# EAGLE design logic (EAGLE 6.4)

## Sheet 1 of 6
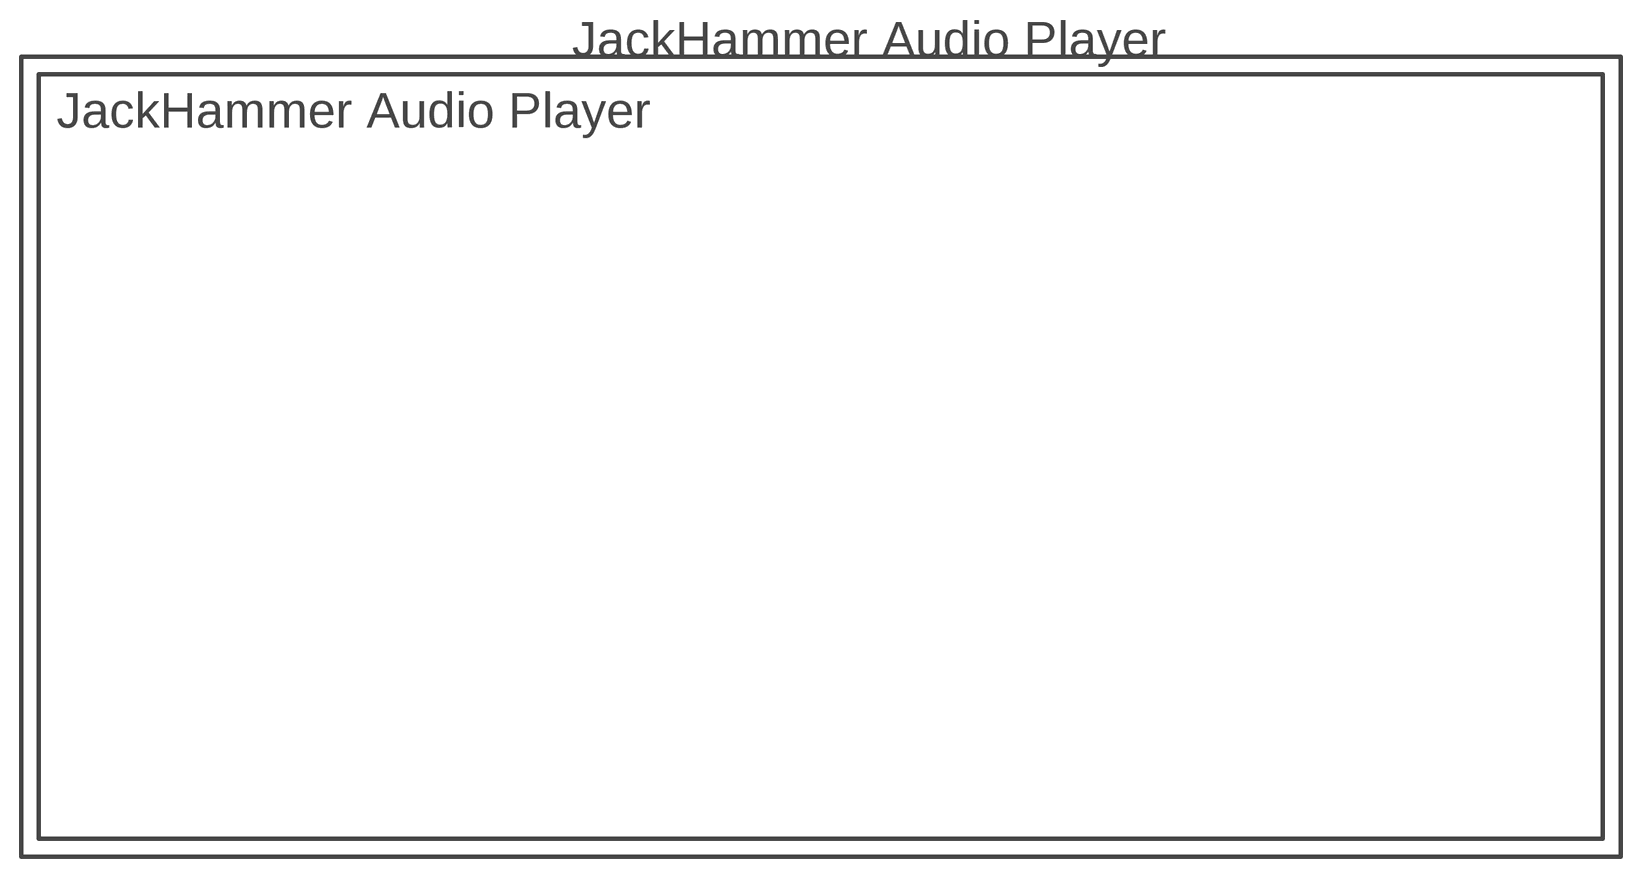
[diagram p0: schematic, sheet 1]

### Notes on the sheet
- JackHammer Audio Player
- JackHammer Audio Player

## Sheet 2 of 6: Positive
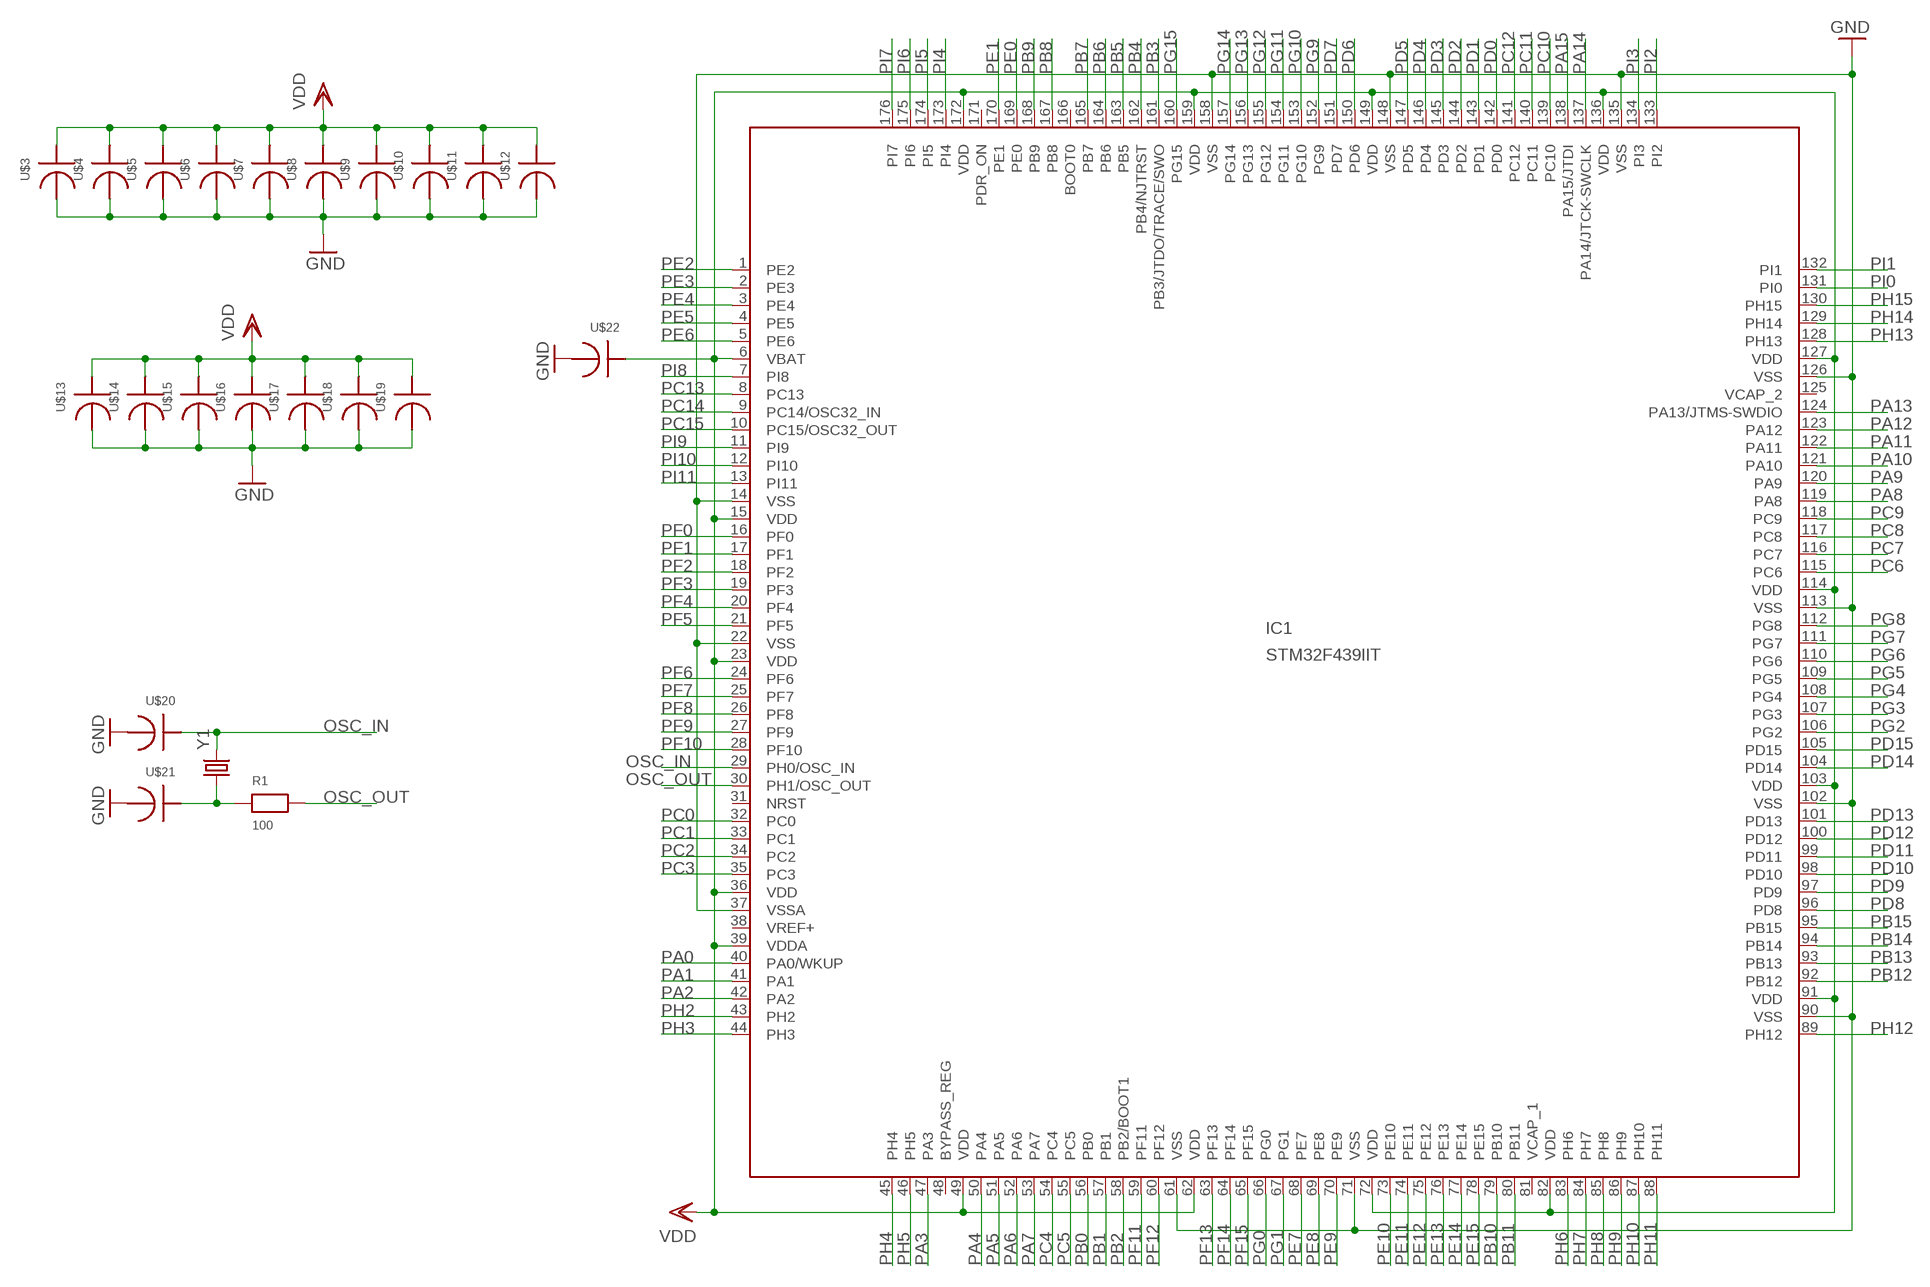
[diagram p1: schematic, sheet 2]

### Parts
IC1  STM32F439IIT  [LQFP-176]
R1  100  PRES0402LEVEL3  [R0402]
U$3  PCAP0402LEVEL3  [R0402]
U$4  PCAP0402LEVEL3  [R0402]
U$5  PCAP0402LEVEL3  [R0402]
U$6  PCAP0402LEVEL3  [R0402]
U$7  PCAP0402LEVEL3  [R0402]
U$8  PCAP0402LEVEL3  [R0402]
U$9  PCAP0402LEVEL3  [R0402]
U$10  PCAP0402LEVEL3  [R0402]
U$11  PCAP0402LEVEL3  [R0402]
U$12  PCAP0402LEVEL3  [R0402]
U$13  PCAP0402LEVEL3  [R0402]
U$14  PCAP0402LEVEL3  [R0402]
U$15  PCAP0402LEVEL3  [R0402]
U$16  PCAP0402LEVEL3  [R0402]
U$17  PCAP0402LEVEL3  [R0402]
U$18  PCAP0402LEVEL3  [R0402]
U$19  PCAP0402LEVEL3  [R0402]
U$20  PCAP0402LEVEL3  [R0402]
U$21  PCAP0402LEVEL3  [R0402]
U$22  PCAP0402LEVEL3  [R0402]
Y1  CRYSTALHC49US  [HC49US]

### Nets
GND: IC1.14(VSS) IC1.22(VSS) IC1.37(VSSA) IC1.61(VSS) IC1.71(VSS) IC1.90(VSS) IC1.102(VSS) IC1.113(VSS) IC1.126(VSS) IC1.135(VSS) IC1.148(VSS) IC1.158(VSS) U$3.P$1 U$4.P$1 U$5.P$1 U$6.P$1 U$7.P$1 U$8.P$1 U$9.P$1 U$10.P$1 U$11.P$1 U$12.P$1 U$13.P$1 U$14.P$1 U$15.P$1 U$16.P$1 U$17.P$1 U$18.P$1 U$19.P$1 U$20.P$1 U$21.P$1 U$22.P$1 ; also sheet 3,4,6
N$2: R1.P$1 U$21.P$2 Y1.1
OSC_IN: IC1.29(PH0/OSC_IN) U$20.P$2 Y1.2
OSC_OUT: IC1.30(PH1/OSC_OUT) R1.P$2
PA0: IC1.40(PA0/WKUP)
PA1: IC1.41(PA1)
PA2: IC1.42(PA2)
PA3: IC1.47(PA3)
PA4: IC1.50(PA4)
PA5: IC1.51(PA5)
PA6: IC1.52(PA6)
PA7: IC1.53(PA7)
PA8: IC1.119(PA8)
PA9: IC1.120(PA9)
PA10: IC1.121(PA10)
PA11: IC1.122(PA11)
PA12: IC1.123(PA12)
PA13: IC1.124(PA13/JTMS-SWDIO)
PA14: IC1.137(PA14/JTCK-SWCLK)
PA15: IC1.138(PA15/JTDI)
PB0: IC1.56(PB0)
PB1: IC1.57(PB1)
PB2: IC1.58(PB2/BOOT1) ; also sheet 6
PB3: IC1.161(PB3/JTDO/TRACE/SWO)
PB4: IC1.162(PB4/NJTRST)
PB5: IC1.163(PB5) ; also sheet 3
PB6: IC1.164(PB6) ; also sheet 3
PB7: IC1.165(PB7)
PB8: IC1.167(PB8) ; also sheet 4
PB9: IC1.168(PB9) ; also sheet 4
PB10: IC1.79(PB10) ; also sheet 6
PB11: IC1.80(PB11)
PB12: IC1.92(PB12)
PB13: IC1.93(PB13)
PB14: IC1.94(PB14) ; also sheet 6
PB15: IC1.95(PB15) ; also sheet 6
PC0: IC1.32(PC0) ; also sheet 3
PC1: IC1.33(PC1)
PC2: IC1.34(PC2)
PC3: IC1.35(PC3)
PC4: IC1.54(PC4)
PC5: IC1.55(PC5)
PC6: IC1.115(PC6) ; also sheet 4
PC7: IC1.116(PC7) ; also sheet 4
PC8: IC1.117(PC8) ; also sheet 4
PC9: IC1.118(PC9) ; also sheet 4
PC10: IC1.139(PC10) ; also sheet 4
PC11: IC1.140(PC11) ; also sheet 4
PC12: IC1.141(PC12) ; also sheet 4
PC13: IC1.8(PC13) ; also sheet 6
PC14: IC1.9(PC14/OSC32_IN) ; also sheet 6
PC15: IC1.10(PC15/OSC32_OUT) ; also sheet 6
PD0: IC1.142(PD0) ; also sheet 3
PD1: IC1.143(PD1) ; also sheet 3
PD2: IC1.144(PD2) ; also sheet 4
PD3: IC1.145(PD3)
PD4: IC1.146(PD4)
PD5: IC1.147(PD5)
PD6: IC1.150(PD6)
PD7: IC1.151(PD7)
PD8: IC1.96(PD8) ; also sheet 3
PD9: IC1.97(PD9) ; also sheet 3
PD10: IC1.98(PD10) ; also sheet 3
PD11: IC1.99(PD11)
PD12: IC1.100(PD12)
PD13: IC1.101(PD13)
PD14: IC1.104(PD14) ; also sheet 3
PD15: IC1.105(PD15) ; also sheet 3
PE0: IC1.169(PE0) ; also sheet 3
PE1: IC1.170(PE1) ; also sheet 3
PE2: IC1.1(PE2)
PE3: IC1.2(PE3)
PE4: IC1.3(PE4)
PE5: IC1.4(PE5)
PE6: IC1.5(PE6)
PE7: IC1.68(PE7) ; also sheet 3
PE8: IC1.69(PE8) ; also sheet 3
PE9: IC1.70(PE9) ; also sheet 3
PE10: IC1.73(PE10) ; also sheet 3
PE11: IC1.74(PE11) ; also sheet 3
PE12: IC1.75(PE12) ; also sheet 3
PE13: IC1.76(PE13) ; also sheet 3
PE14: IC1.77(PE14) ; also sheet 3
PE15: IC1.78(PE15) ; also sheet 3
PF0: IC1.16(PF0) ; also sheet 3
PF1: IC1.17(PF1) ; also sheet 3
PF2: IC1.18(PF2) ; also sheet 3
PF3: IC1.19(PF3) ; also sheet 3
PF4: IC1.20(PF4) ; also sheet 3
PF5: IC1.21(PF5) ; also sheet 3
PF6: IC1.24(PF6)
PF7: IC1.25(PF7)
PF8: IC1.26(PF8)
PF9: IC1.27(PF9)
PF10: IC1.28(PF10)
PF11: IC1.59(PF11) ; also sheet 3
PF12: IC1.60(PF12) ; also sheet 3
PF13: IC1.63(PF13) ; also sheet 3
PF14: IC1.64(PF14) ; also sheet 3
PF15: IC1.65(PF15) ; also sheet 3
PG0: IC1.66(PG0) ; also sheet 3
PG1: IC1.67(PG1) ; also sheet 3
PG2: IC1.106(PG2)
PG3: IC1.107(PG3)
PG4: IC1.108(PG4) ; also sheet 3
PG5: IC1.109(PG5) ; also sheet 3
PG6: IC1.110(PG6)
PG7: IC1.111(PG7)
PG8: IC1.112(PG8) ; also sheet 3
PG9: IC1.152(PG9)
PG10: IC1.153(PG10)
PG11: IC1.154(PG11)
PG12: IC1.155(PG12)
PG13: IC1.156(PG13)
PG14: IC1.157(PG14)
PG15: IC1.160(PG15) ; also sheet 3
PH2: IC1.43(PH2)
PH3: IC1.44(PH3)
PH4: IC1.45(PH4)
PH5: IC1.46(PH5)
PH6: IC1.83(PH6)
PH7: IC1.84(PH7)
PH8: IC1.85(PH8)
PH9: IC1.86(PH9)
PH10: IC1.87(PH10)
PH11: IC1.88(PH11)
PH12: IC1.89(PH12)
PH13: IC1.128(PH13)
PH14: IC1.129(PH14)
PH15: IC1.130(PH15)
PI0: IC1.131(PI0)
PI1: IC1.132(PI1)
PI2: IC1.133(PI2)
PI3: IC1.134(PI3)
PI4: IC1.173(PI4)
PI5: IC1.174(PI5)
PI6: IC1.175(PI6)
PI7: IC1.176(PI7)
PI8: IC1.7(PI8)
PI9: IC1.11(PI9)
PI10: IC1.12(PI10)
PI11: IC1.13(PI11)
VDD: IC1.6(VBAT) IC1.15(VDD) IC1.23(VDD) IC1.36(VDD) IC1.39(VDDA) IC1.49(VDD) IC1.62(VDD) IC1.72(VDD) IC1.82(VDD) IC1.91(VDD) IC1.103(VDD) IC1.114(VDD) IC1.127(VDD) IC1.136(VDD) IC1.149(VDD) IC1.159(VDD) IC1.172(VDD) U$3.P$2 U$4.P$2 U$5.P$2 U$6.P$2 U$7.P$2 U$8.P$2 U$9.P$2 U$10.P$2 U$11.P$2 U$12.P$2 U$13.P$2 U$14.P$2 U$15.P$2 U$16.P$2 U$17.P$2 U$18.P$2 U$19.P$2 U$22.P$2 ; also sheet 3,4
Unconnected: IC1.31(NRST) IC1.48(BYPASS_REG) IC1.166(BOOT0)

## Sheet 3 of 6
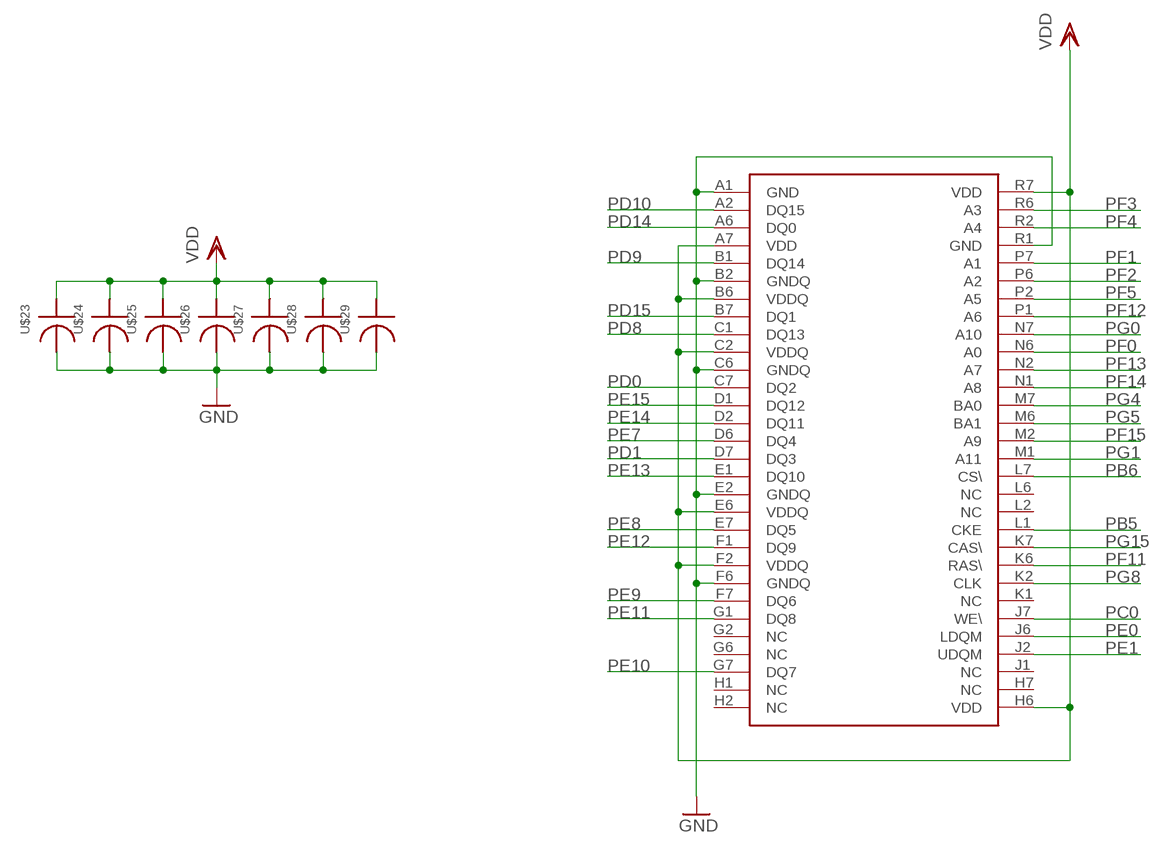
[diagram p2: schematic, sheet 3]

### Parts
U$2  IS42S16400J-BGA60  [BGA-60]
U$23  PCAP0402LEVEL3  [R0402]
U$24  PCAP0402LEVEL3  [R0402]
U$25  PCAP0402LEVEL3  [R0402]
U$26  PCAP0402LEVEL3  [R0402]
U$27  PCAP0402LEVEL3  [R0402]
U$28  PCAP0402LEVEL3  [R0402]
U$29  PCAP0402LEVEL3  [R0402]

### Nets
GND: U$2.A1(GND) U$2.B2(GNDQ) U$2.C6(GNDQ) U$2.E2(GNDQ) U$2.F6(GNDQ) U$2.R1(GND) U$23.P$1 U$24.P$1 U$25.P$1 U$26.P$1 U$27.P$1 U$28.P$1 U$29.P$1 ; also sheet 2,4,6
PB5: U$2.L1(CKE) ; also sheet 2
PB6: U$2.L7(CS\) ; also sheet 2
PC0: U$2.J7(WE\) ; also sheet 2
PD0: U$2.C7(DQ2) ; also sheet 2
PD1: U$2.D7(DQ3) ; also sheet 2
PD8: U$2.C1(DQ13) ; also sheet 2
PD9: U$2.B1(DQ14) ; also sheet 2
PD10: U$2.A2(DQ15) ; also sheet 2
PD14: U$2.A6(DQ0) ; also sheet 2
PD15: U$2.B7(DQ1) ; also sheet 2
PE0: U$2.J6(LDQM) ; also sheet 2
PE1: U$2.J2(UDQM) ; also sheet 2
PE7: U$2.D6(DQ4) ; also sheet 2
PE8: U$2.E7(DQ5) ; also sheet 2
PE9: U$2.F7(DQ6) ; also sheet 2
PE10: U$2.G7(DQ7) ; also sheet 2
PE11: U$2.G1(DQ8) ; also sheet 2
PE12: U$2.F1(DQ9) ; also sheet 2
PE13: U$2.E1(DQ10) ; also sheet 2
PE14: U$2.D2(DQ11) ; also sheet 2
PE15: U$2.D1(DQ12) ; also sheet 2
PF0: U$2.N6(A0) ; also sheet 2
PF1: U$2.P7(A1) ; also sheet 2
PF2: U$2.P6(A2) ; also sheet 2
PF3: U$2.R6(A3) ; also sheet 2
PF4: U$2.R2(A4) ; also sheet 2
PF5: U$2.P2(A5) ; also sheet 2
PF11: U$2.K6(RAS\) ; also sheet 2
PF12: U$2.P1(A6) ; also sheet 2
PF13: U$2.N2(A7) ; also sheet 2
PF14: U$2.N1(A8) ; also sheet 2
PF15: U$2.M2(A9) ; also sheet 2
PG0: U$2.N7(A10) ; also sheet 2
PG1: U$2.M1(A11) ; also sheet 2
PG4: U$2.M7(BA0) ; also sheet 2
PG5: U$2.M6(BA1) ; also sheet 2
PG8: U$2.K2(CLK) ; also sheet 2
PG15: U$2.K7(CAS\) ; also sheet 2
VDD: U$2.A7(VDD) U$2.B6(VDDQ) U$2.C2(VDDQ) U$2.E6(VDDQ) U$2.F2(VDDQ) U$2.H6(VDD) U$2.R7(VDD) U$23.P$2 U$24.P$2 U$25.P$2 U$26.P$2 U$27.P$2 U$28.P$2 U$29.P$2 ; also sheet 2,4
Unconnected: U$2.G2(NC) U$2.G6(NC) U$2.H1(NC) U$2.H2(NC) U$2.H7(NC) U$2.J1(NC) U$2.K1(NC) U$2.L2(NC) U$2.L6(NC)

## Sheet 4 of 6: eMMC
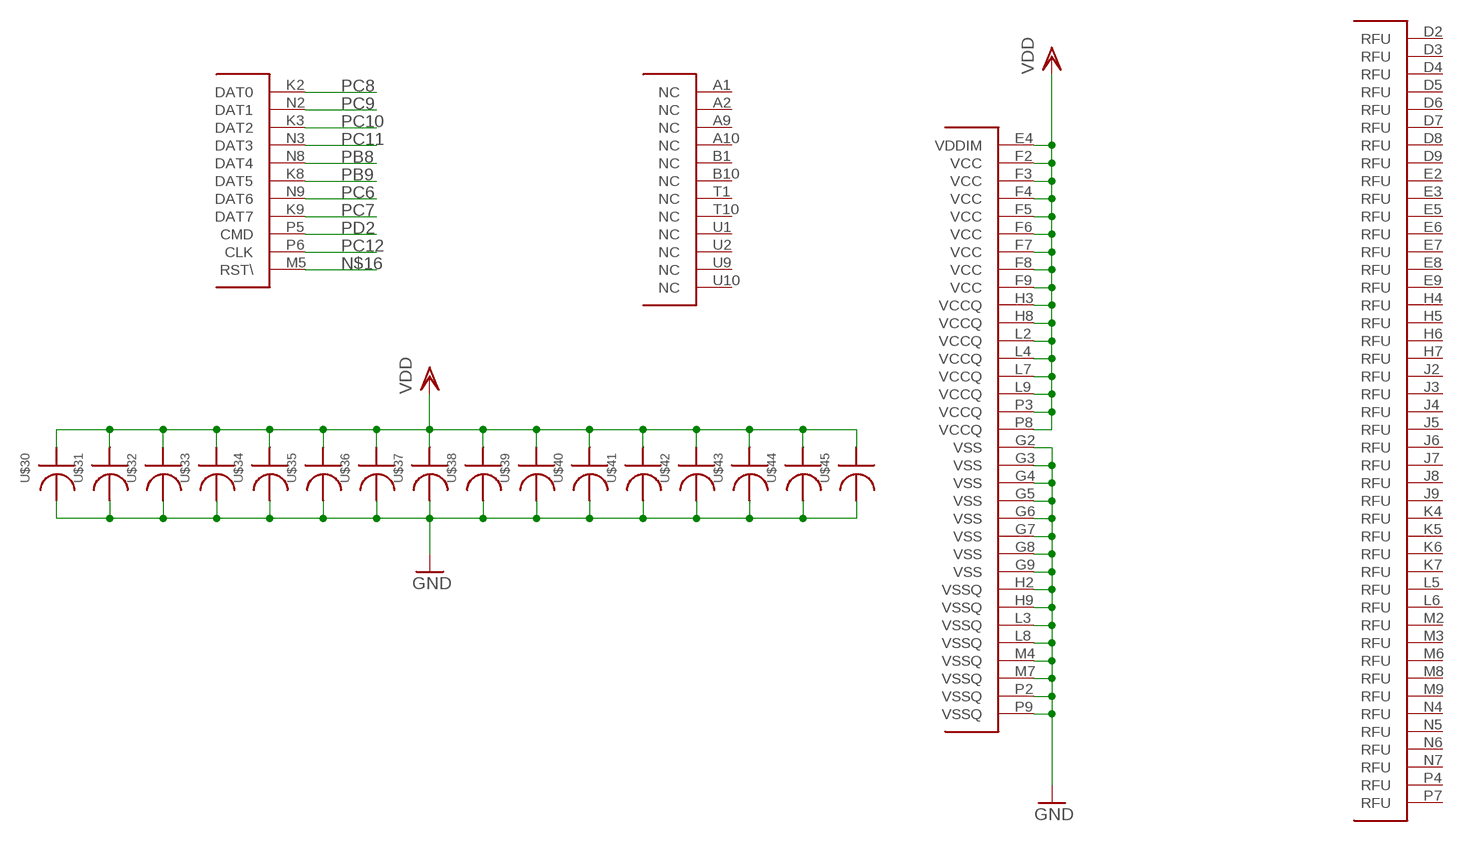
[diagram p3: schematic, sheet 4]

### Parts
U$1  MTFC4GACAANA-4M  [BGA-100]
U$30  PCAP0402LEVEL3  [R0402]
U$31  PCAP0402LEVEL3  [R0402]
U$32  PCAP0402LEVEL3  [R0402]
U$33  PCAP0402LEVEL3  [R0402]
U$34  PCAP0402LEVEL3  [R0402]
U$35  PCAP0402LEVEL3  [R0402]
U$36  PCAP0402LEVEL3  [R0402]
U$37  PCAP0402LEVEL3  [R0402]
U$38  PCAP0402LEVEL3  [R0402]
U$39  PCAP0402LEVEL3  [R0402]
U$40  PCAP0402LEVEL3  [R0402]
U$41  PCAP0402LEVEL3  [R0402]
U$42  PCAP0402LEVEL3  [R0402]
U$43  PCAP0402LEVEL3  [R0402]
U$44  PCAP0402LEVEL3  [R0402]
U$45  PCAP0402LEVEL3  [R0402]

### Nets
GND: U$1.G2(VSS) U$1.G3(VSS) U$1.G4(VSS) U$1.G5(VSS) U$1.G6(VSS) U$1.G7(VSS) U$1.G8(VSS) U$1.G9(VSS) U$1.H2(VSSQ) U$1.H9(VSSQ) U$1.L3(VSSQ) U$1.L8(VSSQ) U$1.M4(VSSQ) U$1.M7(VSSQ) U$1.P2(VSSQ) U$1.P9(VSSQ) U$30.P$1 U$31.P$1 U$32.P$1 U$33.P$1 U$34.P$1 U$35.P$1 U$36.P$1 U$37.P$1 U$38.P$1 U$39.P$1 U$40.P$1 U$41.P$1 U$42.P$1 U$43.P$1 U$44.P$1 U$45.P$1 ; also sheet 2,3,6
N$16: U$1.M5(RST\)
PB8: U$1.N8(DAT4) ; also sheet 2
PB9: U$1.K8(DAT5) ; also sheet 2
PC6: U$1.N9(DAT6) ; also sheet 2
PC7: U$1.K9(DAT7) ; also sheet 2
PC8: U$1.K2(DAT0) ; also sheet 2
PC9: U$1.N2(DAT1) ; also sheet 2
PC10: U$1.K3(DAT2) ; also sheet 2
PC11: U$1.N3(DAT3) ; also sheet 2
PC12: U$1.P6(CLK) ; also sheet 2
PD2: U$1.P5(CMD) ; also sheet 2
VDD: U$1.E4(VDDIM) U$1.F2(VCC) U$1.F3(VCC) U$1.F4(VCC) U$1.F5(VCC) U$1.F6(VCC) U$1.F7(VCC) U$1.F8(VCC) U$1.F9(VCC) U$1.H3(VCCQ) U$1.H8(VCCQ) U$1.L2(VCCQ) U$1.L4(VCCQ) U$1.L7(VCCQ) U$1.L9(VCCQ) U$1.P3(VCCQ) U$1.P8(VCCQ) U$30.P$2 U$31.P$2 U$32.P$2 U$33.P$2 U$34.P$2 U$35.P$2 U$36.P$2 U$37.P$2 U$38.P$2 U$39.P$2 U$40.P$2 U$41.P$2 U$42.P$2 U$43.P$2 U$44.P$2 U$45.P$2 ; also sheet 2,3
Unconnected: U$1.A1(NC) U$1.A2(NC) U$1.A9(NC) U$1.A10(NC) U$1.B1(NC) U$1.B10(NC) U$1.D2(RFU) U$1.D3(RFU) U$1.D4(RFU) U$1.D5(RFU) U$1.D6(RFU) U$1.D7(RFU) U$1.D8(RFU) U$1.D9(RFU) U$1.E2(RFU) U$1.E3(RFU) U$1.E5(RFU) U$1.E6(RFU) U$1.E7(RFU) U$1.E8(RFU) U$1.E9(RFU) U$1.H4(RFU) U$1.H5(RFU) U$1.H6(RFU) U$1.H7(RFU) U$1.J2(RFU) U$1.J3(RFU) U$1.J4(RFU) U$1.J5(RFU) U$1.J6(RFU) U$1.J7(RFU) U$1.J8(RFU) U$1.J9(RFU) U$1.K4(RFU) U$1.K5(RFU) U$1.K6(RFU) U$1.K7(RFU) U$1.L5(RFU) U$1.L6(RFU) U$1.M2(RFU) U$1.M3(RFU) U$1.M6(RFU) U$1.M8(RFU) U$1.M9(RFU) U$1.N4(RFU) U$1.N5(RFU) U$1.N6(RFU) U$1.N7(RFU) U$1.P4(RFU) U$1.P7(RFU) U$1.T1(NC) U$1.T10(NC) U$1.U1(NC) U$1.U2(NC) U$1.U9(NC) U$1.U10(NC)

## Sheet 5 of 6: ALFAT
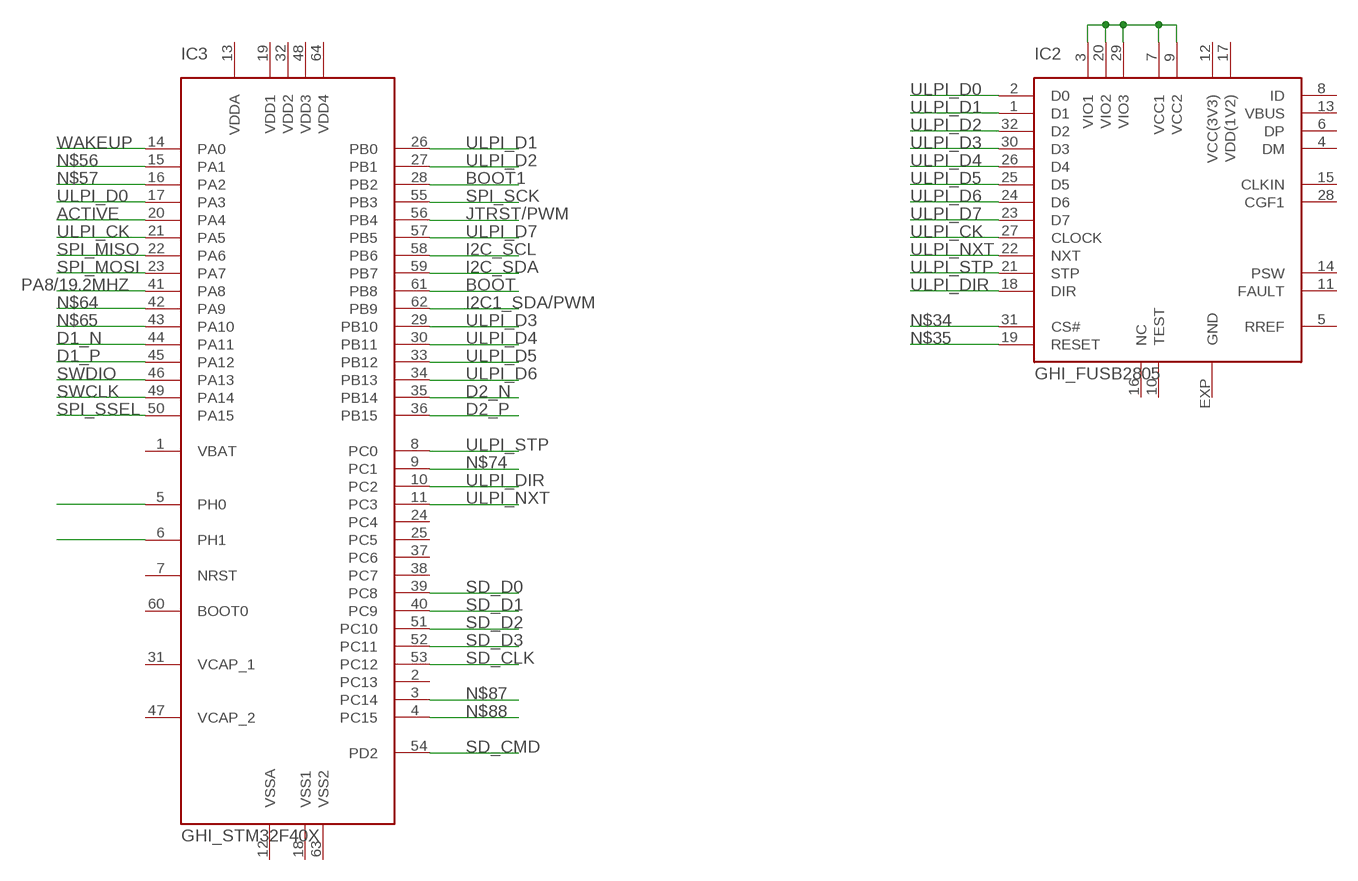
[diagram p4: schematic, sheet 5]

### Parts
IC2  GHI_FUSB2805  [GHI_MLP32]
IC3  GHI_STM32F40X  [GHI_LQFP64]

### Nets
ACTIVE: IC3.20(PA4)
BOOT: IC3.61(PB8)
BOOT1: IC3.28(PB2)
D1_N: IC3.44(PA11)
D1_P: IC3.45(PA12)
D2_N: IC3.35(PB14)
D2_P: IC3.36(PB15)
I2C1_SDA/PWM: IC3.62(PB9)
I2C_SCL: IC3.58(PB6)
I2C_SDA: IC3.59(PB7)
JTRST/PWM: IC3.56(PB4)
N$4: IC2.3(VIO1) IC2.7(VCC1) IC2.9(VCC2) IC2.20(VIO2) IC2.29(VIO3)
N$34: IC2.31(CS#)
N$35: IC2.19(RESET)
N$56: IC3.15(PA1)
N$57: IC3.16(PA2)
N$64: IC3.42(PA9)
N$65: IC3.43(PA10)
N$71: IC3.5(PH0)
N$72: IC3.6(PH1)
N$74: IC3.9(PC1)
N$87: IC3.3(PC14)
N$88: IC3.4(PC15)
PA8/19.2MHZ: IC3.41(PA8)
SD_CLK: IC3.53(PC12)
SD_CMD: IC3.54(PD2)
SD_D0: IC3.39(PC8)
SD_D1: IC3.40(PC9)
SD_D2: IC3.51(PC10)
SD_D3: IC3.52(PC11)
SPI_MISO: IC3.22(PA6)
SPI_MOSI: IC3.23(PA7)
SPI_SCK: IC3.55(PB3)
SPI_SSEL: IC3.50(PA15)
SWCLK: IC3.49(PA14)
SWDIO: IC3.46(PA13)
ULPI_CK: IC2.27(CLOCK) IC3.21(PA5)
ULPI_D0: IC2.2(D0) IC3.17(PA3)
ULPI_D1: IC2.1(D1) IC3.26(PB0)
ULPI_D2: IC2.32(D2) IC3.27(PB1)
ULPI_D3: IC2.30(D3) IC3.29(PB10)
ULPI_D4: IC2.26(D4) IC3.30(PB11)
ULPI_D5: IC2.25(D5) IC3.33(PB12)
ULPI_D6: IC2.24(D6) IC3.34(PB13)
ULPI_D7: IC2.23(D7) IC3.57(PB5)
ULPI_DIR: IC2.18(DIR) IC3.10(PC2)
ULPI_NXT: IC2.22(NXT) IC3.11(PC3)
ULPI_STP: IC2.21(STP) IC3.8(PC0)
WAKEUP: IC3.14(PA0)
Unconnected: IC2.4(DM) IC2.5(RREF) IC2.6(DP) IC2.8(ID) IC2.10(TEST) IC2.11(FAULT) IC2.12(VCC(3V3)) IC2.13(VBUS) IC2.14(PSW) IC2.15(CLKIN) IC2.16(NC) IC2.17(VDD(1V2)) IC2.28(CGF1) IC2.EXP(GND) IC3.1(VBAT) IC3.2(PC13) IC3.7(NRST) IC3.12(VSSA) IC3.13(VDDA) IC3.18(VSS1) IC3.19(VDD1) IC3.24(PC4) IC3.25(PC5) IC3.31(VCAP_1) IC3.32(VDD2) IC3.37(PC6) IC3.38(PC7) IC3.47(VCAP_2) IC3.48(VDD3) IC3.60(BOOT0) IC3.63(VSS2) IC3.64(VDD4)

## Sheet 6 of 6: VS1063
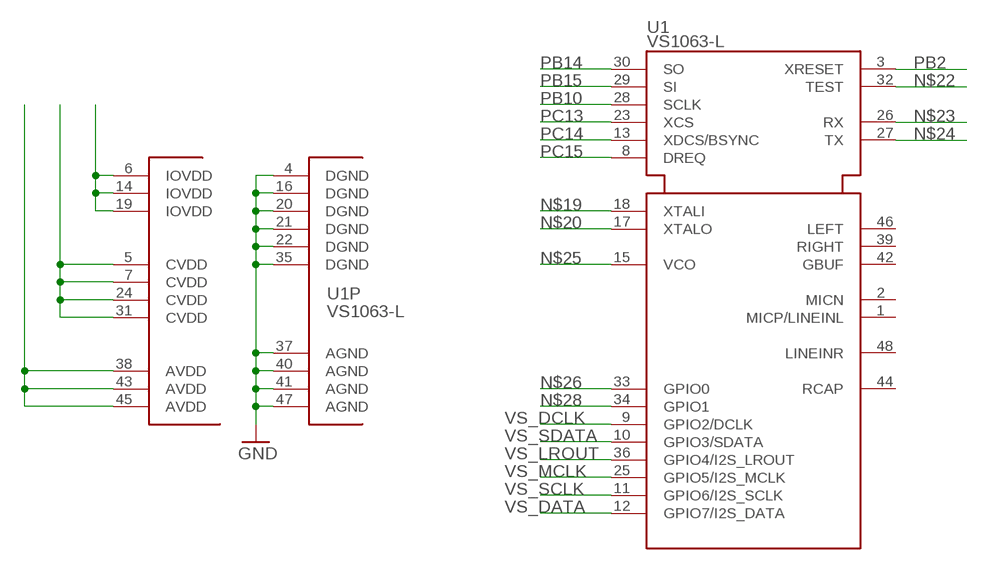
[diagram p5: schematic, sheet 6]

### Parts
U1  VS1063-L  [LQFP48]

### Nets
GND: U1.4(DGND) U1.16(DGND) U1.20(DGND) U1.21(DGND) U1.22(DGND) U1.35(DGND) U1.37(AGND) U1.40(AGND) U1.41(AGND) U1.47(AGND) ; also sheet 2,3,4
N$19: U1.18(XTALI)
N$20: U1.17(XTALO)
N$22: U1.32(TEST)
N$23: U1.26(RX)
N$24: U1.27(TX)
N$25: U1.15(VCO)
N$26: U1.33(GPIO0)
N$28: U1.34(GPIO1)
N$36: U1.6(IOVDD) U1.14(IOVDD) U1.19(IOVDD)
N$37: U1.5(CVDD) U1.7(CVDD) U1.24(CVDD) U1.31(CVDD)
N$38: U1.38(AVDD) U1.43(AVDD) U1.45(AVDD)
PB2: U1.3(XRESET) ; also sheet 2
PB10: U1.28(SCLK) ; also sheet 2
PB14: U1.30(SO) ; also sheet 2
PB15: U1.29(SI) ; also sheet 2
PC13: U1.23(XCS) ; also sheet 2
PC14: U1.13(XDCS/BSYNC) ; also sheet 2
PC15: U1.8(DREQ) ; also sheet 2
VS_DATA: U1.12(GPIO7/I2S_DATA)
VS_DCLK: U1.9(GPIO2/DCLK)
VS_LROUT: U1.36(GPIO4/I2S_LROUT)
VS_MCLK: U1.25(GPIO5/I2S_MCLK)
VS_SCLK: U1.11(GPIO6/I2S_SCLK)
VS_SDATA: U1.10(GPIO3/SDATA)
Unconnected: U1.1(MICP/LINEINL) U1.2(MICN) U1.39(RIGHT) U1.42(GBUF) U1.44(RCAP) U1.46(LEFT) U1.48(LINEINR)

## Power pins joined to a net without a drawn wire
PDR_ON: IC1.171(PDR_ON)
VCAP_1: IC1.81(VCAP_1)
VCAP_2: IC1.125(VCAP_2)
VREF+: IC1.38(VREF+)

## Library data of the parts
IC1 = STM32F439IIT:STM32F439IIT: edit this description Auto generated by make-symbol-device-package-bsdl.ulp Rev. 43 Source:
IC2 = ALFAT_Lib:GHI_FUSB2805
IC3 = ALFAT_Lib:GHI_STM32F40X
R1 = rcl_pro:PRES0402
U1 = vlsi-web:VS1063: MP3 / OGG / AAC / WMA / FLAC / G.711 / G.722 Audio Codec
U$1 = mtfc4gacaana-4m:MTFC4GACAANA-4M
U$2 = IS42S16400J:IS42S16400J-BGA60
U$3-U$45 = rcl_pro:PCAP0402
Y1 = SparkFun-FreqCtrl:CRYSTAL: Various standard crystals. Proven footprints. Spark Fun Electronics SKU : COM-00534

## Board
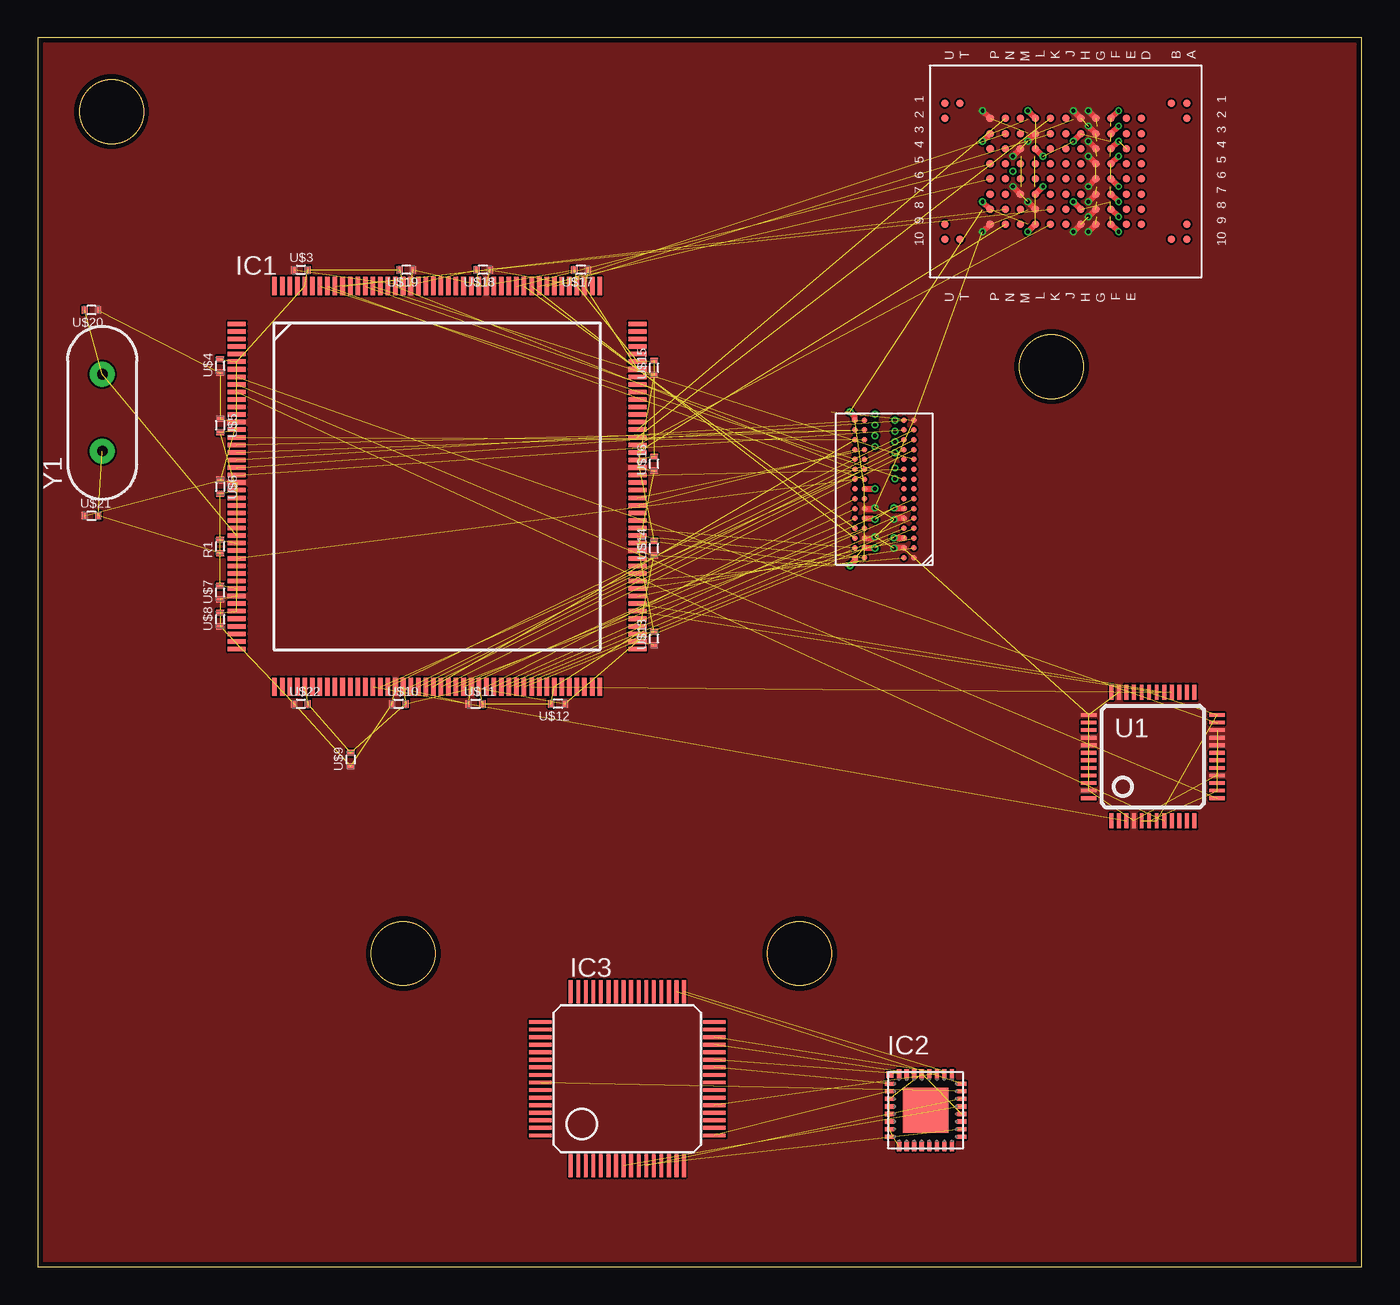
[diagram p6: board, top side]
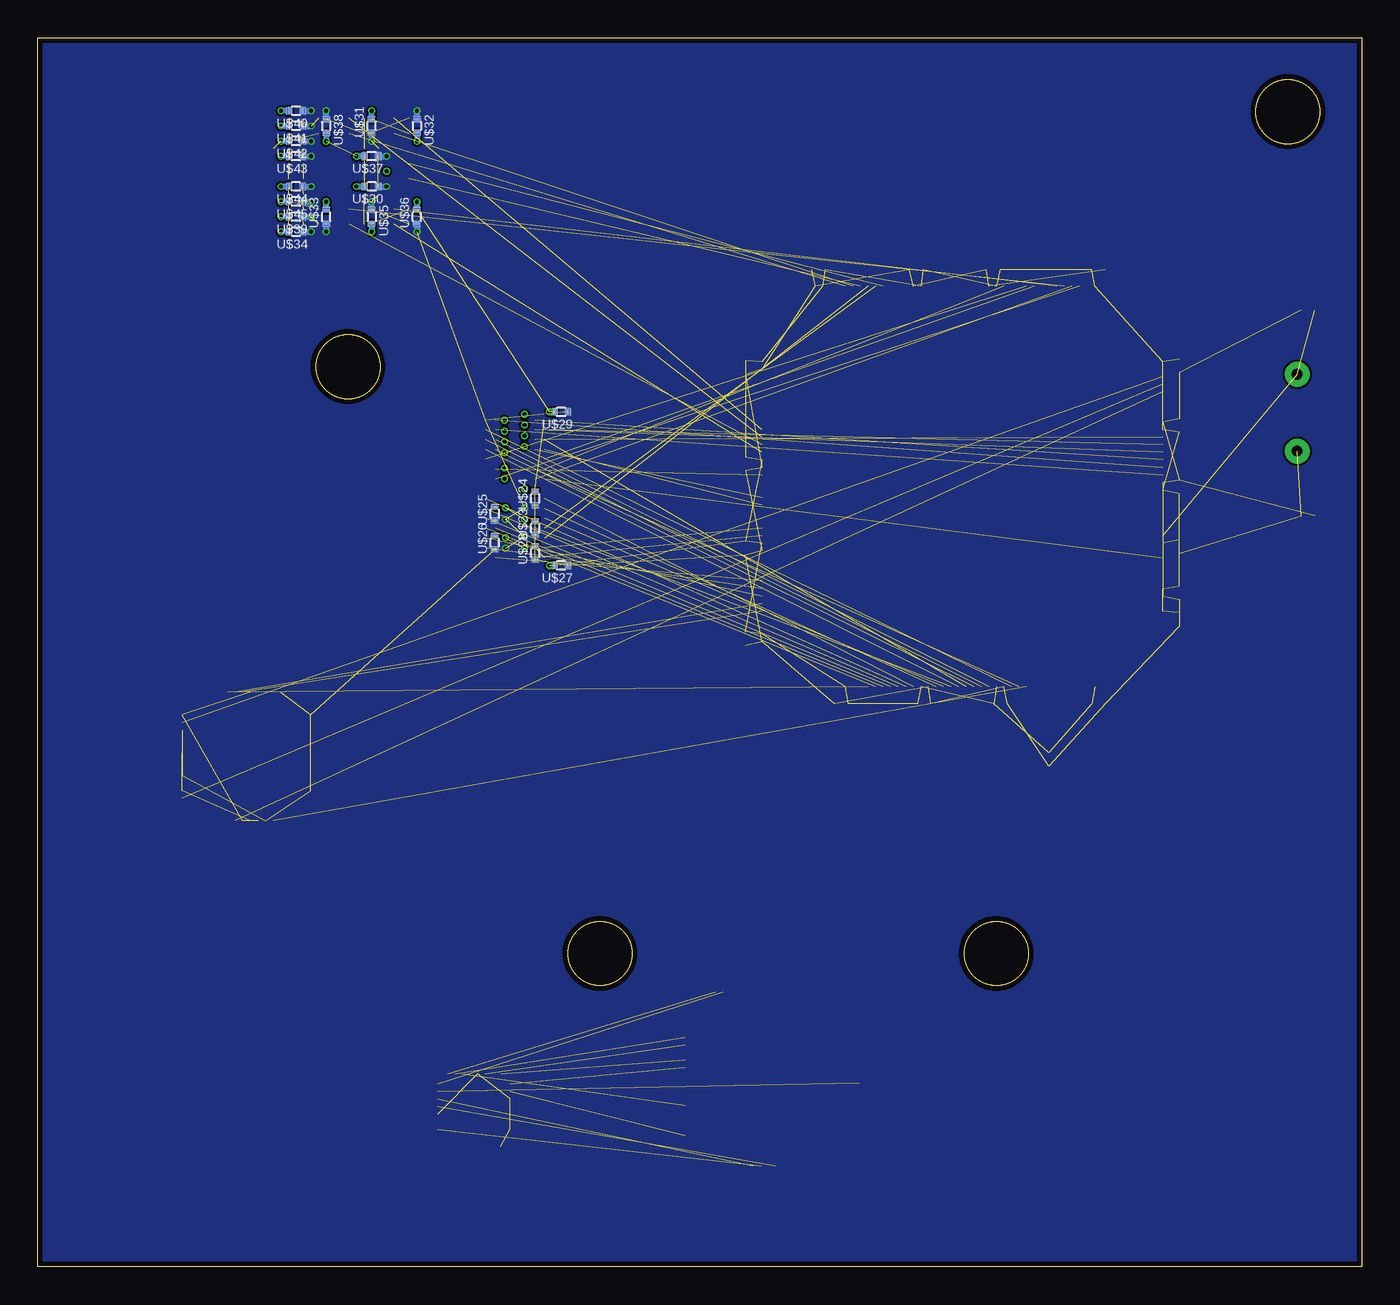
[diagram p7: board, bottom side, seen from below]

Size 87.58 x 81.28 mm. Coordinates in mm from the lower left corner, seen from the top.
Outline: 0,0 87.58,0 87.58,81.28 0,81.28 0,0
Outline: circle at 24.18,20.73 radius 2.12
Outline: circle at 50.39,20.73 radius 2.12
Outline: circle at 4.88,76.4 radius 2.12
Outline: circle at 67.06,59.54 radius 2.12
Copper layers (1*2*3*16): Top 0.035mm / dielectric 1.5mm / Route2 0.035mm / dielectric 0.15mm / Route3 0.035mm / dielectric 0.2mm / Bottom 0.035mm
Design rules "default *": minimum track width 5mil, minimum drill 10mil, track to track 5mil, track to pad 5mil, pad to pad 5mil, via to via 5mil, smd to smd 5mil, copper to edge 13mil, drill to drill 8mil, minimum pad ring 4mil, minimum via ring 4mil, stop-mask expansion 4mil, vias tented up to drill 14mil, thermal gap 10mil

### Footprints (pad centres in the part's own frame; a part is rotated, then mirrored left to right if it is on the bottom)
LQFP-176 = smd 1.2 x 0.3: 1 -13.25,10.75; 2 -13.25,10.25; 3 -13.25,9.75; 4 -13.25,9.25; 5 -13.25,8.75; 6 -13.25,8.25; 7 -13.25,7.75; 8 -13.25,7.25; 9 -13.25,6.75; 10 -13.25,6.25; 11 -13.25,5.75; 12 -13.25,5.25; 13 -13.25,4.75; 14 -13.25,4.25; 15 -13.25,3.75; 16 -13.25,3.25; 17 -13.25,2.75; 18 -13.25,2.25; 19 -13.25,1.75; 20 -13.25,1.25; 21 -13.25,0.75; 22 -13.25,0.25; 23 -13.25,-0.25; 24 -13.25,-0.75; 25 -13.25,-1.25; 26 -13.25,-1.75; 27 -13.25,-2.25; 28 -13.25,-2.75; 29 -13.25,-3.25; 30 -13.25,-3.75; 31 -13.25,-4.25; 32 -13.25,-4.75; 33 -13.25,-5.25; 34 -13.25,-5.75; 35 -13.25,-6.25; 36 -13.25,-6.75; 37 -13.25,-7.25; 38 -13.25,-7.75; 39 -13.25,-8.25; 40 -13.25,-8.75; 41 -13.25,-9.25; 42 -13.25,-9.75; 43 -13.25,-10.25; 44 -13.25,-10.75; 89 13.25,-10.75; 90 13.25,-10.25; 91 13.25,-9.75; 92 13.25,-9.25; 93 13.25,-8.75; 94 13.25,-8.25; 95 13.25,-7.75; 96 13.25,-7.25; 97 13.25,-6.75; 98 13.25,-6.25; 99 13.25,-5.75; 100 13.25,-5.25; 101 13.25,-4.75; 102 13.25,-4.25; 103 13.25,-3.75; 104 13.25,-3.25; 105 13.25,-2.75; 106 13.25,-2.25; 107 13.25,-1.75; 108 13.25,-1.25; 109 13.25,-0.75; 110 13.25,-0.25; 111 13.25,0.25; 112 13.25,0.75; 113 13.25,1.25; 114 13.25,1.75; 115 13.25,2.25; 116 13.25,2.75; 117 13.25,3.25; 118 13.25,3.75; 119 13.25,4.25; 120 13.25,4.75; 121 13.25,5.25; 122 13.25,5.75; 123 13.25,6.25; 124 13.25,6.75; 125 13.25,7.25; 126 13.25,7.75; 127 13.25,8.25; 128 13.25,8.75; 129 13.25,9.25; 130 13.25,9.75; 131 13.25,10.25; 132 13.25,10.75 | smd 0.3 x 1.2: 45 -10.75,-13.25; 46 -10.25,-13.25; 47 -9.75,-13.25; 48 -9.25,-13.25; 49 -8.75,-13.25; 50 -8.25,-13.25; 51 -7.75,-13.25; 52 -7.25,-13.25; 53 -6.75,-13.25; 54 -6.25,-13.25; 55 -5.75,-13.25; 56 -5.25,-13.25; 57 -4.75,-13.25; 58 -4.25,-13.25; 59 -3.75,-13.25; 60 -3.25,-13.25; 61 -2.75,-13.25; 62 -2.25,-13.25; 63 -1.75,-13.25; 64 -1.25,-13.25; 65 -0.75,-13.25; 66 -0.25,-13.25; 67 0.25,-13.25; 68 0.75,-13.25; 69 1.25,-13.25; 70 1.75,-13.25; 71 2.25,-13.25; 72 2.75,-13.25; 73 3.25,-13.25; 74 3.75,-13.25; 75 4.25,-13.25; 76 4.75,-13.25; 77 5.25,-13.25; 78 5.75,-13.25; 79 6.25,-13.25; 80 6.75,-13.25; 81 7.25,-13.25; 82 7.75,-13.25; 83 8.25,-13.25; 84 8.75,-13.25; 85 9.25,-13.25; 86 9.75,-13.25; 87 10.25,-13.25; 88 10.75,-13.25; 133 10.75,13.25; 134 10.25,13.25; 135 9.75,13.25; 136 9.25,13.25; 137 8.75,13.25; 138 8.25,13.25; 139 7.75,13.25; 140 7.25,13.25; 141 6.75,13.25; 142 6.25,13.25; 143 5.75,13.25; 144 5.25,13.25; 145 4.75,13.25; 146 4.25,13.25; 147 3.75,13.25; 148 3.25,13.25; 149 2.75,13.25; 150 2.25,13.25; 151 1.75,13.25; 152 1.25,13.25; 153 0.75,13.25; 154 0.25,13.25; 155 -0.25,13.25; 156 -0.75,13.25; 157 -1.25,13.25; 158 -1.75,13.25; 159 -2.25,13.25; 160 -2.75,13.25; 161 -3.25,13.25; 162 -3.75,13.25; 163 -4.25,13.25; 164 -4.75,13.25; 165 -5.25,13.25; 166 -5.75,13.25; 167 -6.25,13.25; 168 -6.75,13.25; 169 -7.25,13.25; 170 -7.75,13.25; 171 -8.25,13.25; 172 -8.75,13.25; 173 -9.25,13.25; 174 -9.75,13.25; 175 -10.25,13.25; 176 -10.75,13.25
GHI_MLP32 = smd 0.6 x 0.28: 1 -2.4,1.75; 2 -2.4,1.25; 3 -2.4,0.75; 4 -2.4,0.25; 5 -2.4,-0.25; 6 -2.4,-0.75; 7 -2.4,-1.25; 8 -2.4,-1.75; 17 2.4,-1.75; 18 2.4,-1.25; 19 2.4,-0.75; 20 2.4,-0.25; 21 2.4,0.25; 22 2.4,0.75; 23 2.4,1.25; 24 2.4,1.75 | smd 0.28 x 0.6: 9 -1.75,-2.4; 10 -1.25,-2.4; 11 -0.75,-2.4; 12 -0.25,-2.4; 13 0.25,-2.4; 14 0.75,-2.4; 15 1.25,-2.4; 16 1.75,-2.4; 25 1.75,2.4; 26 1.25,2.4; 27 0.75,2.4; 28 0.25,2.4; 29 -0.25,2.4; 30 -0.75,2.4; 31 -1.25,2.4; 32 -1.75,2.4 | smd 3 x 3: EXP 0,0 | smd 0.435 x 0.435: M -2.353,2.353
GHI_LQFP64 = smd 0.25 x 1.5: 1 -3.75,-5.75; 2 -3.25,-5.75; 3 -2.75,-5.75; 4 -2.25,-5.75; 5 -1.75,-5.75; 6 -1.25,-5.75; 7 -0.75,-5.75; 8 -0.25,-5.75; 9 0.25,-5.75; 10 0.75,-5.75; 11 1.25,-5.75; 12 1.75,-5.75; 13 2.25,-5.75; 14 2.75,-5.75; 15 3.25,-5.75; 16 3.75,-5.75; 33 3.75,5.75; 34 3.25,5.75; 35 2.75,5.75; 36 2.25,5.75; 37 1.75,5.75; 38 1.25,5.75; 39 0.75,5.75; 40 0.25,5.75; 41 -0.25,5.75; 42 -0.75,5.75; 43 -1.25,5.75; 44 -1.75,5.75; 45 -2.25,5.75; 46 -2.75,5.75; 47 -3.25,5.75; 48 -3.75,5.75 | smd 1.5 x 0.25: 17 5.75,-3.75; 18 5.75,-3.25; 19 5.75,-2.75; 20 5.75,-2.25; 21 5.75,-1.75; 22 5.75,-1.25; 23 5.75,-0.75; 24 5.75,-0.25; 25 5.75,0.25; 26 5.75,0.75; 27 5.75,1.25; 28 5.75,1.75; 29 5.75,2.25; 30 5.75,2.75; 31 5.75,3.25; 32 5.75,3.75; 49 -5.75,3.75; 50 -5.75,3.25; 51 -5.75,2.75; 52 -5.75,2.25; 53 -5.75,1.75; 54 -5.75,1.25; 55 -5.75,0.75; 56 -5.75,0.25; 57 -5.75,-0.25; 58 -5.75,-0.75; 59 -5.75,-1.25; 60 -5.75,-1.75; 61 -5.75,-2.25; 62 -5.75,-2.75; 63 -5.75,-3.25; 64 -5.75,-3.75
R0402 = smd 0.4 x 0.5: P$1 -0.45,0; P$2 0.45,0
LQFP48 = smd 0.25 x 1: 1 -2.75,-4.25; 2 -2.25,-4.25; 3 -1.75,-4.25; 4 -1.25,-4.25; 5 -0.75,-4.25; 6 -0.25,-4.25; 7 0.25,-4.25; 8 0.75,-4.25; 9 1.25,-4.25; 10 1.75,-4.25; 11 2.25,-4.25; 12 2.75,-4.25; 25 2.75,4.25; 26 2.25,4.25; 27 1.75,4.25; 28 1.25,4.25; 29 0.75,4.25; 30 0.25,4.25; 31 -0.25,4.25; 32 -0.75,4.25; 33 -1.25,4.25; 34 -1.75,4.25; 35 -2.25,4.25; 36 -2.75,4.25 | smd 1 x 0.25: 13 4.25,-2.75; 14 4.25,-2.25; 15 4.25,-1.75; 16 4.25,-1.25; 17 4.25,-0.75; 18 4.25,-0.25; 19 4.25,0.25; 20 4.25,0.75; 21 4.25,1.25; 22 4.25,1.75; 23 4.25,2.25; 24 4.25,2.75; 37 -4.25,2.75; 38 -4.25,2.25; 39 -4.25,1.75; 40 -4.25,1.25; 41 -4.25,0.75; 42 -4.25,0.25; 43 -4.25,-0.25; 44 -4.25,-0.75; 45 -4.25,-1.25; 46 -4.25,-1.75; 47 -4.25,-2.25; 48 -4.25,-2.75
BGA-100 = smd 0.5 x 0.5: A1 -4.5,8; A2 -3.5,8; A9 3.5,8; A10 4.5,8; B1 -4.5,7; B10 4.5,7; D2 -3.5,5; D3 -2.5,5; D4 -1.5,5; D5 -0.5,5; D6 0.5,5; D7 1.5,5; D8 2.5,5; D9 3.5,5; E2 -3.5,4; E3 -2.5,4; E4 -1.5,4; E5 -0.5,4; E6 0.5,4; E7 1.5,4; E8 2.5,4; E9 3.5,4; F2 -3.5,3; F3 -2.5,3; F4 -1.5,3; F5 -0.5,3; F6 0.5,3; F7 1.5,3; F8 2.5,3; F9 3.5,3; G2 -3.5,2; G3 -2.5,2; G4 -1.5,2; G5 -0.5,2; G6 0.5,2; G7 1.5,2; G8 2.5,2; G9 3.5,2; H2 -3.5,1; H3 -2.5,1; H4 -1.5,1; H5 -0.5,1; H6 0.5,1; H7 1.5,1; H8 2.5,1; H9 3.5,1; J2 -3.5,0; J3 -2.5,0; J4 -1.5,0; J5 -0.5,0; J6 0.5,0; J7 1.5,0; J8 2.5,0; J9 3.5,0; K2 -3.5,-1; K3 -2.5,-1; K4 -1.5,-1; K5 -0.5,-1; K6 0.5,-1; K7 1.5,-1; K8 2.5,-1; K9 3.5,-1; L2 -3.5,-2; L3 -2.5,-2; L4 -1.5,-2; L5 -0.5,-2; L6 0.5,-2; L7 1.5,-2; L8 2.5,-2; L9 3.5,-2; M2 -3.5,-3; M3 -2.5,-3; M4 -1.5,-3; M5 -0.5,-3; M6 0.5,-3; M7 1.5,-3; M8 2.5,-3; M9 3.5,-3; N2 -3.5,-4; N3 -2.5,-4; N4 -1.5,-4; N5 -0.5,-4; N6 0.5,-4; N7 1.5,-4; N8 2.5,-4; N9 3.5,-4; P2 -3.5,-5; P3 -2.5,-5; P4 -1.5,-5; P5 -0.5,-5; P6 0.5,-5; P7 1.5,-5; P8 2.5,-5; P9 3.5,-5; T1 -4.5,-7; T10 4.5,-7; U1 -4.5,-8; U2 -3.5,-8; U9 3.5,-8; U10 4.5,-8
BGA-60 = smd 0.38 x 0.38: A1 -4.55,-1.95; A2 -4.55,-1.3; A6 -4.55,1.3; A7 -4.55,1.95; B1 -3.9,-1.95; B2 -3.9,-1.3; B6 -3.9,1.3; B7 -3.9,1.95; C1 -3.25,-1.95; C2 -3.25,-1.3; C6 -3.25,1.3; C7 -3.25,1.95; D1 -2.6,-1.95; D2 -2.6,-1.3; D6 -2.6,1.3; D7 -2.6,1.95; E1 -1.95,-1.95; E2 -1.95,-1.3; E6 -1.95,1.3; E7 -1.95,1.95; F1 -1.3,-1.95; F2 -1.3,-1.3; F6 -1.3,1.3; F7 -1.3,1.95; G1 -0.65,-1.95; G2 -0.65,-1.3; G6 -0.65,1.3; G7 -0.65,1.95; H1 0,-1.95; H2 0,-1.3; H6 0,1.3; H7 0,1.95; J1 0.65,-1.95; J2 0.65,-1.3; J6 0.65,1.3; J7 0.65,1.95; K1 1.3,-1.95; K2 1.3,-1.3; K6 1.3,1.3; K7 1.3,1.95; L1 1.95,-1.95; L2 1.95,-1.3; L6 1.95,1.3; L7 1.95,1.95; M1 2.6,-1.95; M2 2.6,-1.3; M6 2.6,1.3; M7 2.6,1.95; N1 3.25,-1.95; N2 3.25,-1.3; N6 3.25,1.3; N7 3.25,1.95; P1 3.9,-1.95; P2 3.9,-1.3; P6 3.9,1.3; P7 3.9,1.95; R1 4.55,-1.95; R2 4.55,-1.3; R6 4.55,1.3; R7 4.55,1.95
HC49US = drill 0.7 pad 1.651: 1 -2.54,0; 2 2.54,0

### Placement (x,y rotation side)
IC1  26.42,51.61 0 top
IC2  58.72,10.36 0 top
IC3  39,12.45 0 top
R1  12.06,47.65 90 top
U1  73.76,33.75 0 top
U$1  68,72.45 270 top
U$2  56,51.45 90 top
U$3  17.4,65.94 0 top
U$4  12.06,59.59 90 top
U$5  12.06,55.65 270 top
U$6  12.06,51.59 270 top
U$7  12.06,44.6 90 top
U$8  12.06,42.82 90 top
U$9  20.7,33.55 90 top
U$10  23.88,37.24 0 top
U$11  28.96,37.24 0 top
U$12  34.42,37.24 180 top
U$13  40.77,41.55 90 top
U$14  40.77,47.52 90 top
U$15  40.77,59.46 90 top
U$16  40.77,53.11 90 top
U$17  35.94,65.94 180 top
U$18  29.46,65.94 180 top
U$19  24.38,65.94 180 top
U$20  3.56,63.27 180 top
U$21  3.56,49.68 0 top
U$22  17.4,37.24 0 top
U$23  54.67,48.86 90 bottom
U$24  54.67,50.83 90 bottom
U$25  57.34,49.81 90 bottom
U$26  57.34,47.9 90 bottom
U$27  52.96,46.38 180 bottom
U$28  54.67,47.21 90 bottom
U$29  52.96,56.54 180 bottom
U$30  65.5,71.45 180 bottom
U$31  65.5,75.45 90 bottom
U$32  62.5,75.45 270 bottom
U$33  68.5,69.45 90 bottom
U$34  70.5,68.45 180 bottom
U$35  65.5,69.45 270 bottom
U$36  62.5,69.45 90 bottom
U$37  65.5,73.45 180 bottom
U$38  68.5,75.45 270 bottom
U$39  70.5,69.45 180 bottom
U$40  70.5,76.45 180 bottom
U$41  70.5,75.45 180 bottom
U$42  70.5,74.45 180 bottom
U$43  70.5,73.45 180 bottom
U$44  70.5,71.45 180 bottom
U$45  70.5,70.45 180 bottom
Y1  4.27,56.49 90 top

### Tracks (layer width: path | path; a pad name or v marks a point on that pad's centre or on a via)
GND  (via drill 0.25 pad 0.36)  (70 unrouted)
  Top 0.406: U$2.F6 55.2,50.15 v55.37,50.19 | U$2.E2 56.84,49.5 v56.64,49.43 | U$2.C6 55.16,48.2 v55.37,48.29 | U$2.B2 56.66,47.55 v56.64,47.52 | U$1.G3 v69.5,75.45 | U$1.G2 v69.5,76.45 | U$1.G4 v69.5,74.45 | U$1.G5 v69.5,73.45 | U$1.G6 v69.5,71.45 | U$1.G7 v69.5,70.45 | U$1.G8 v69.5,69.45 | U$1.G9 v69.5,68.45 | U$1.H2 v68.5,76.45 | U$1.H9 v68.5,68.45 | U$1.L3 v65.5,74.45 | U$1.M4 v64.5,73.45 | U$1.M7 v64.5,71.45 | U$1.L8 v65.5,70.45 | U$1.P9 v62.5,68.45 | U$1.P2 v62.5,76.45
  Bottom 0.406: U$40.P$1 v69.5,76.45 | U$41.P$1 v69.5,75.45 | U$34.P$1 v69.5,68.45 | U$39.P$1 v69.5,69.45 | U$45.P$1 v69.5,70.45 | U$44.P$1 v69.5,71.45 | U$43.P$1 v69.5,73.45 | U$42.P$1 v69.5,74.45 | U$38.P$1 v68.5,76.45 | U$33.P$1 v68.5,68.45 | U$31.P$1 v65.5,74.45 | U$37.P$1 v64.5,73.45 | U$30.P$1 v64.5,71.45 | U$35.P$1 v65.5,70.45 | U$32.P$1 v62.5,76.45 | U$36.P$1 v62.5,68.45
  pour Top (rank 6, no thermals): 0.41,80.87 87.17,80.87 87.17,0.41 0.41,0.41
  pour Bottom (rank 6, no thermals): 0.41,80.87 87.17,80.87 87.17,0.41 0.41,0.41
N$1  (via drill 0.25 pad 0.36)
  other vias: 56.69,55.98
N$2  (2 unrouted)
N$3  (via drill 0.25 pad 0.36)
  other vias: 56.69,55.27
N$4  (4 unrouted)
N$8  (via drill 0.25 pad 0.36)
  other vias: 56.69,54.56
N$9  (via drill 0.25 pad 0.36)
  other vias: 56.69,53.85
N$10  (via drill 0.25 pad 0.36)
  other vias: 56.69,52.83
N$11  (via drill 0.25 pad 0.36)
  other vias: 56.69,52.12
N$12  (via drill 0.25 pad 0.36)
  other vias: 55.37,56.39
N$13  (via drill 0.25 pad 0.36)
  other vias: 55.37,55.68
N$14  (via drill 0.25 pad 0.36)
  other vias: 55.37,54.97
N$15  (via drill 0.25 pad 0.36)
  other vias: 55.37,54.25
N$27  (via drill 0.25 pad 0.36)
  other vias: 64.5,72.45
N$36  (2 unrouted)
N$37  (3 unrouted)
N$38  (2 unrouted)
OSC_IN  (2 unrouted)
OSC_OUT  (1 unrouted)
PB2  (1 unrouted)
PB5  (1 unrouted)
PB6  (1 unrouted)
PB8  (1 unrouted)
PB9  (1 unrouted)
PB10  (1 unrouted)
PB14  (1 unrouted)
PB15  (1 unrouted)
PC0  (1 unrouted)
PC6  (1 unrouted)
PC7  (1 unrouted)
PC8  (1 unrouted)
PC9  (1 unrouted)
PC10  (1 unrouted)
PC11  (1 unrouted)
PC12  (1 unrouted)
PC13  (1 unrouted)
PC14  (1 unrouted)
PC15  (1 unrouted)
PD0  (1 unrouted)
PD1  (1 unrouted)
PD2  (1 unrouted)
PD8  (1 unrouted)
PD9  (1 unrouted)
PD10  (1 unrouted)
PD14  (1 unrouted)
PD15  (1 unrouted)
PE0  (1 unrouted)
PE1  (1 unrouted)
PE7  (1 unrouted)
PE8  (1 unrouted)
PE9  (1 unrouted)
PE10  (1 unrouted)
PE11  (1 unrouted)
PE12  (1 unrouted)
PE13  (1 unrouted)
PE14  (1 unrouted)
PE15  (1 unrouted)
PF0  (1 unrouted)
PF1  (1 unrouted)
PF2  (1 unrouted)
PF3  (1 unrouted)
PF4  (1 unrouted)
PF5  (1 unrouted)
PF11  (1 unrouted)
PF12  (1 unrouted)
PF13  (1 unrouted)
PF14  (1 unrouted)
PF15  (1 unrouted)
PG0  (1 unrouted)
PG1  (1 unrouted)
PG4  (1 unrouted)
PG5  (1 unrouted)
PG8  (1 unrouted)
PG15  (1 unrouted)
ULPI_CK  (1 unrouted)
ULPI_D0  (1 unrouted)
ULPI_D1  (1 unrouted)
ULPI_D2  (1 unrouted)
ULPI_D3  (1 unrouted)
ULPI_D4  (1 unrouted)
ULPI_D5  (1 unrouted)
ULPI_D6  (1 unrouted)
ULPI_D7  (1 unrouted)
ULPI_DIR  (1 unrouted)
ULPI_NXT  (1 unrouted)
ULPI_STP  (1 unrouted)
VDD  (via drill 0.25, 0.25 pad 0.36)  (65 unrouted)
  Top 0.406: U$2.A7 54.05,46.71 v53.72,46.38 | U$2.B6 55.27,47.55 v55.37,47.52 | U$2.E6 55.18,49.5 v55.37,49.43 | U$2.H6 55.26,51.45 v55.37,51.46 | U$2.F2 56.81,50.15 v56.64,50.19 | U$2.C2 56.79,48.2 v56.64,48.22 | U$2.R7 54.05,56.21 v53.72,56.54 | U$1.F2 v71.5,76.45 | U$1.F3 v71.5,75.45 | U$1.F4 v71.5,74.45 | U$1.F5 v71.5,73.45 | U$1.F6 v71.5,71.45 | U$1.F7 v71.5,70.45 | U$1.F8 v71.5,69.45 | U$1.F9 v71.5,68.45 | U$1.H3 v68.5,74.45 | U$1.H8 v68.5,70.45 | U$1.L2 v65.5,76.45 | U$1.L4 v66.5,73.45 | U$1.L7 v66.5,71.45 | U$1.L9 v65.5,68.45 | U$1.P8 v62.5,70.45 | U$1.P3 v62.5,74.45
  Bottom 0.406: U$34.P$2 v71.5,68.45 | U$39.P$2 v71.5,69.45 | U$45.P$2 v71.5,70.45 | U$44.P$2 v71.5,71.45 | U$41.P$2 v71.5,75.45 | U$42.P$2 v71.5,74.45 | U$43.P$2 v71.5,73.45 | U$40.P$2 v71.5,76.45 | U$38.P$2 v68.5,74.45 | U$33.P$2 v68.5,70.45 | U$31.P$2 v65.5,76.45 | U$37.P$2 v66.5,73.45 | U$30.P$2 v66.5,71.45 | U$35.P$2 v65.5,68.45 | U$32.P$2 v62.5,74.45 | U$36.P$2 v62.5,70.45